# Altium project A3000_4MB.PrjPcb
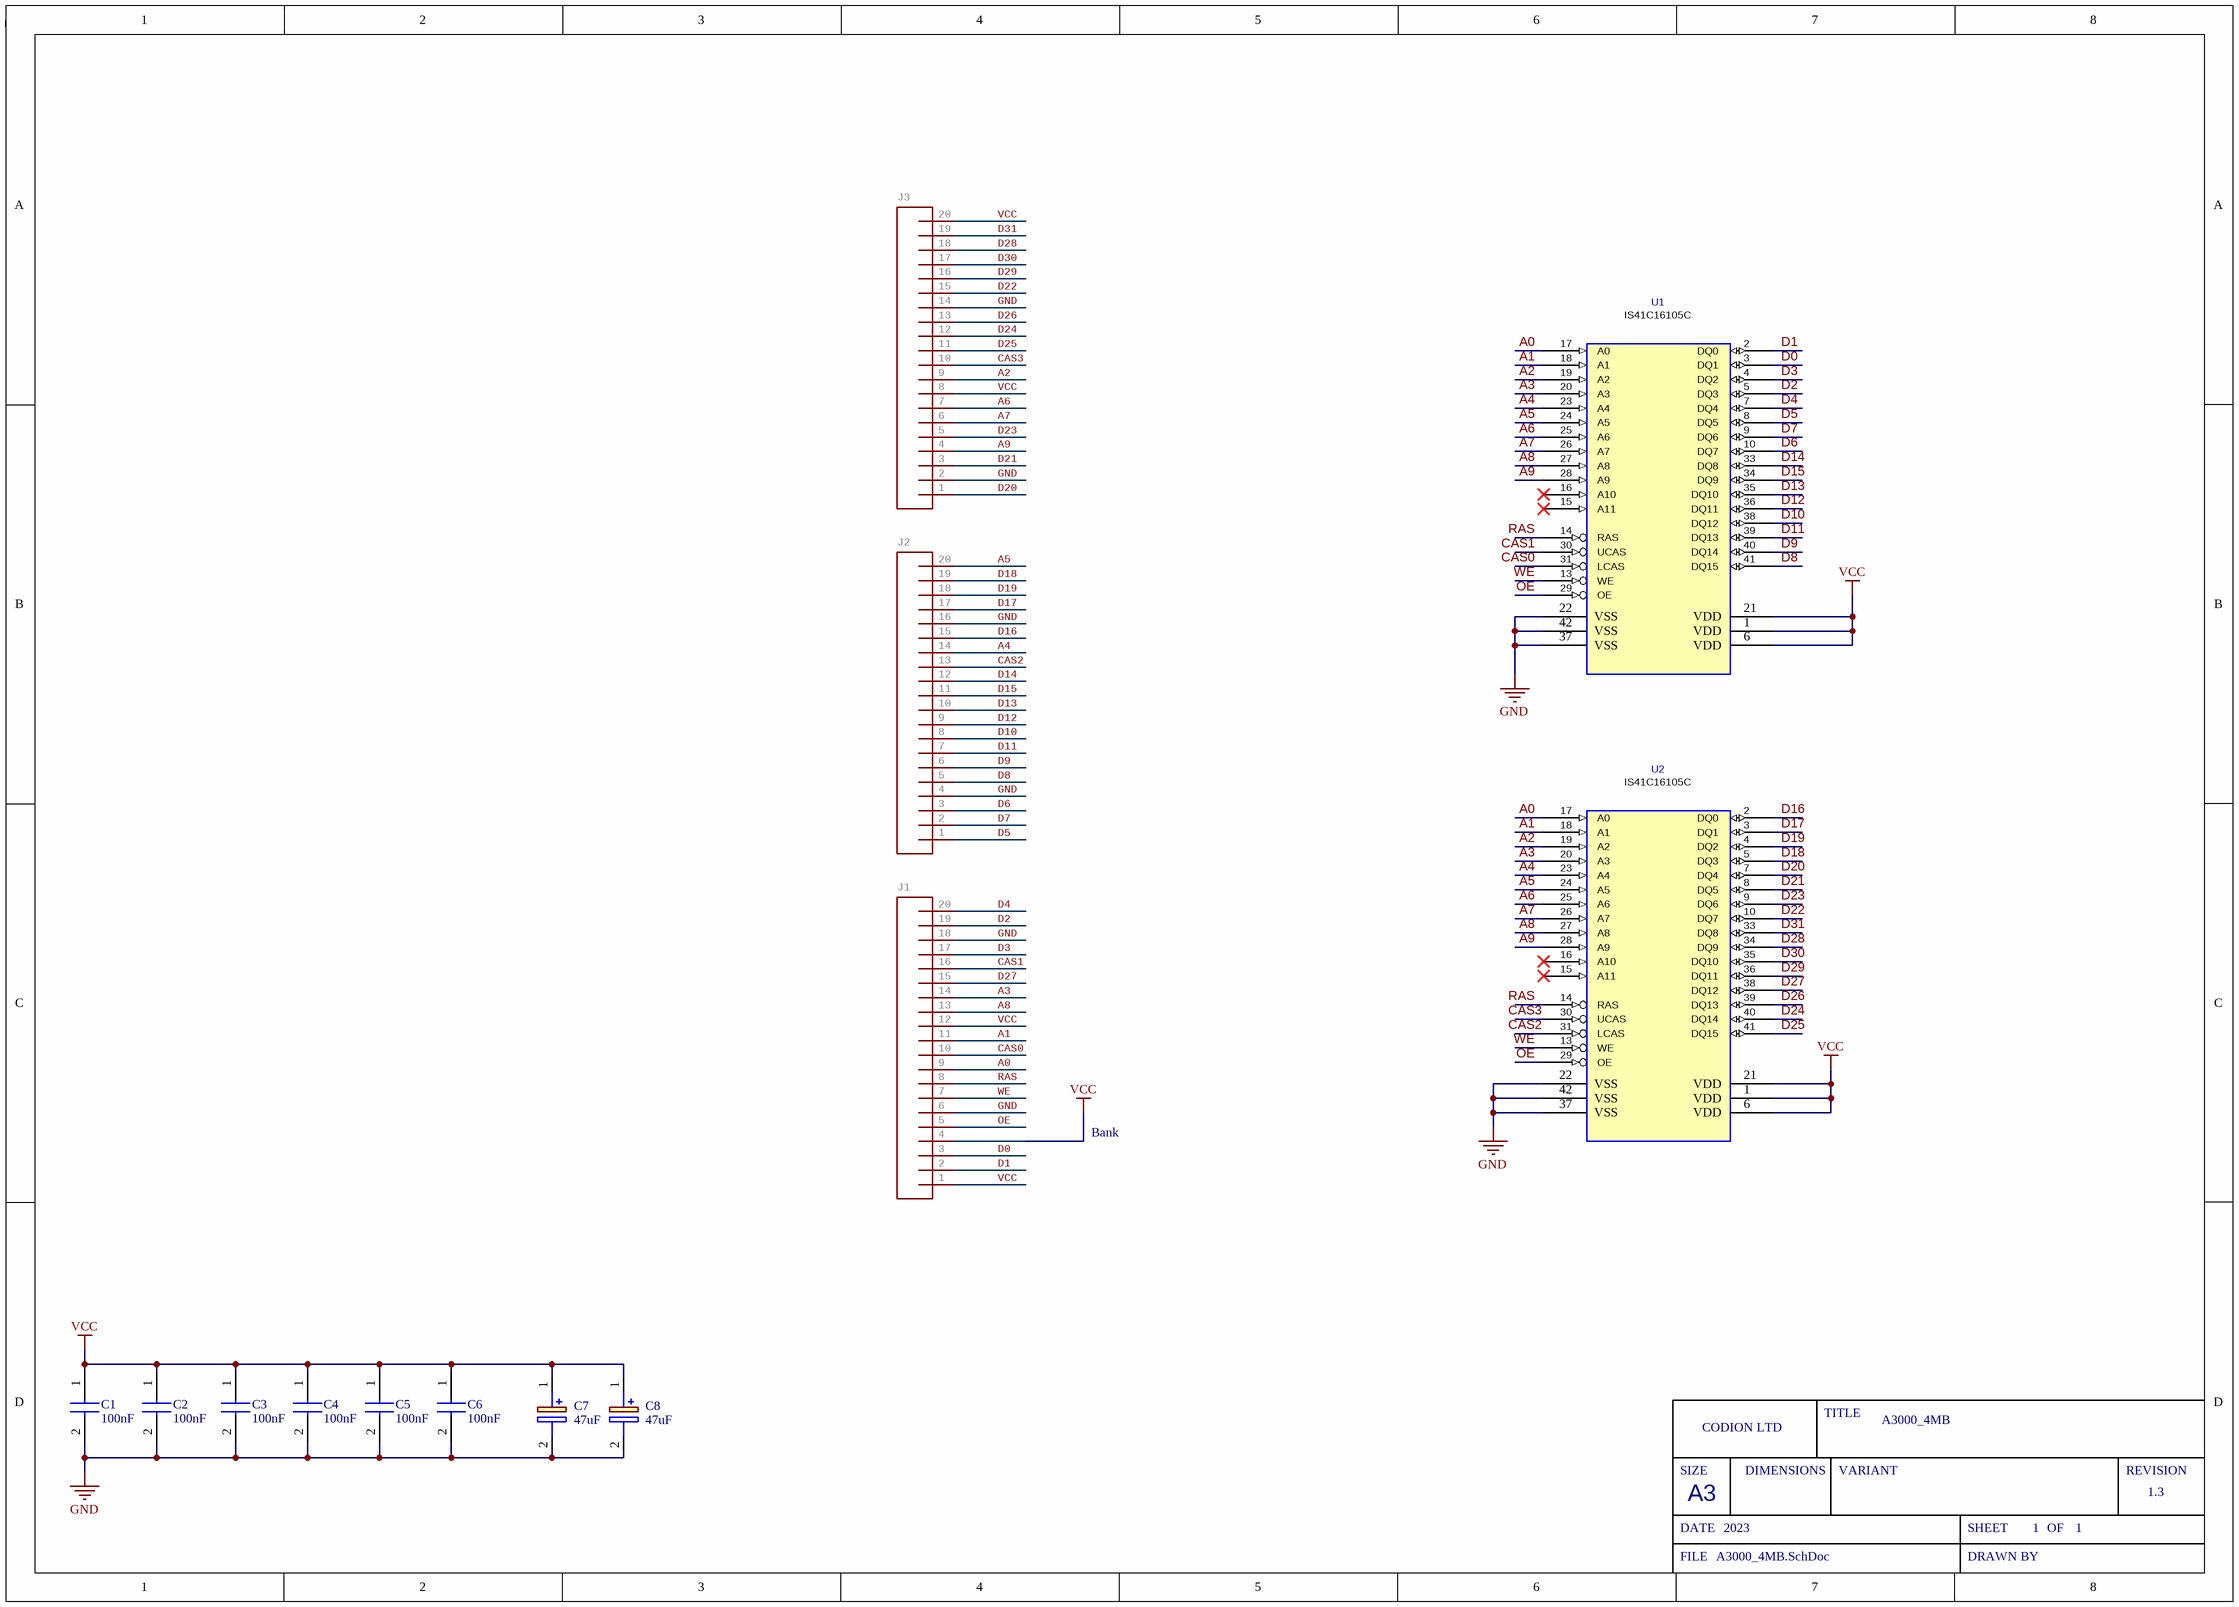
[diagram p0: A3000_4MB.SchDoc]
Sch_RevNo: 1.3; Sch_releaseDate: 2023; Project_Title: A3000_4MB; ProjectName: A3000_4MB; PCB_RevNo: 1.3; Engineer_Name: Codion Ltd; BOM_RevNo: 1.0
1 sheet, 13 parts. Net scope: global (net labels, ports and power ports of the same name join across sheets).
Board file: A3000_4MB.pcbdoc

## Sheet A3000_4MB.SchDoc: ARM2 to ARM3 Adapter
size A3; DocumentNumber: 1; SheetNumber: 1; SheetTotal: 1

### Parts
C1  100nF  [CAPC2012X145N]
C2  100nF  [CAPC2012X145N]
C3  100nF  [CAPC2012X145N]
C4  100nF  [CAPC2012X145N]
C5  100nF  [CAPC2012X145N]
C6  100nF  [CAPC2012X145N]
C7  47uF  [EEE1AA101SP]
C8  47uF  [EEE1AA101SP]
J1  CONN_20  [1X20]  (value not drawn)
J2  CONN_20  [1X20]  (value not drawn)
J3  CONN_20  [1X20]  (value not drawn)
U1  IS41C16105C  [SOJ-42]
U2  IS41C16105C  [SOJ-42]

### Nets
GND: C1.2 C2.2 C3.2 C4.2 C5.2 C6.2 C7.2(-) C8.2(-) J1.6 J1.18 J2.4 J2.16 J3.2 J3.14 U1.22(VSS) U1.37(VSS) U1.42(VSS) U2.22(VSS) U2.37(VSS) U2.42(VSS)
VCC: C1.1 C2.1 C3.1 C4.1 C5.1 C6.1 C7.1(+) C8.1(+) J1.1 J1.4 J1.12 J3.8 J3.20 U1.1(VCC) U1.6(VCC) U1.21(VCC) U2.1(VCC) U2.6(VCC) U2.21(VCC)
A0: J1.9 U1.17(A0) U2.17(A0)
A1: J1.11 U1.18(A1) U2.18(A1)
A2: J3.9 U1.19(A2) U2.19(A2)
A3: J1.14 U1.20(A3) U2.20(A3)
A4: J2.14 U1.23(A4) U2.23(A4)
A5: J2.20 U1.24(A5) U2.24(A5)
A6: J3.7 U1.25(A6) U2.25(A6)
A7: J3.6 U1.26(A7) U2.26(A7)
A8: J1.13 U1.27(A8) U2.27(A8)
A9: J3.4 U1.28(A9) U2.28(A9)
CAS0: J1.10 U1.31(LCAS)
CAS1: J1.16 U1.30(UCAS)
CAS2: J2.13 U2.31(LCAS)
CAS3: J3.10 U2.30(UCAS)
D0: J1.3 U1.3(DQ1)
D1: J1.2 U1.2(DQ0)
D2: J1.19 U1.5(DQ3)
D3: J1.17 U1.4(DQ2)
D4: J1.20 U1.7(DQ4)
D5: J2.1 U1.8(DQ5)
D6: J2.3 U1.10(DQ7)
D7: J2.2 U1.9(DQ6)
D8: J2.5 U1.41(DQ15)
D9: J2.6 U1.40(DQ14)
D10: J2.8 U1.38(DQ12)
D11: J2.7 U1.39(DQ13)
D12: J2.9 U1.36(DQ11)
D13: J2.10 U1.35(DQ10)
D14: J2.12 U1.33(DQ8)
D15: J2.11 U1.34(DQ9)
D16: J2.15 U2.2(DQ0)
D17: J2.17 U2.3(DQ1)
D18: J2.19 U2.5(DQ3)
D19: J2.18 U2.4(DQ2)
D20: J3.1 U2.7(DQ4)
D21: J3.3 U2.8(DQ5)
D22: J3.15 U2.10(DQ7)
D23: J3.5 U2.9(DQ6)
D24: J3.12 U2.40(DQ14)
D25: J3.11 U2.41(DQ15)
D26: J3.13 U2.39(DQ13)
D27: J1.15 U2.38(DQ12)
D28: J3.18 U2.34(DQ9)
D29: J3.16 U2.36(DQ11)
D30: J3.17 U2.35(DQ10)
D31: J3.19 U2.33(DQ8)
OE: J1.5 U1.29(OE) U2.29(OE)
RAS: J1.8 U1.14(RAS) U2.14(RAS)
WE: J1.7 U1.13(WE) U2.13(WE)

Not connected (* = marked no-connect by the designer): U1 15(A11)* 16(A10)*; U2 15(A11)* 16(A10)*

### Notes on the sheet
- Bank
- SIZE
- CODION LTD
- DIMENSIONS
- TITLE
- VARIANT
- REVISION
- DATE
- A3
- SHEET
- OF
- FILE
- DRAWN BY

### Library data of the parts
C1-C6 = C2012X7R1H104K125AM: Capacitor; Manufacturer_Name: TDK; Datasheet Link: https://product.tdk.com/info/en/catalog/datasheets/mlcc_commercial_midvoltage_en.pdf; Height: 1.45mm; Manufacturer_Part_Number: C2012X7R1H104K125AM; Mouser Part Number: 810-C2012X7R1H104KT5; Mouser Price/Stock: https://www.mouser.com/Search/Refine.aspx?Keyword=810-C2012X7R1H104KT5; Arrow Part Number: C2012X7R1H104K125AM; Arrow Price/Stock: https://www.arrow.com/en/products/c2012x7r1h104k125am/tdk
C7 C8 = EEE1VA470WP: Capacitor Polarised; Manufacturer_Name: Panasonic; Datasheet Link: http://industrial.panasonic.com/cdbs/www-data/pdf/RDE0000/ABA0000C1145.pdf; Height: 7.8mm; Manufacturer_Part_Number: EEE1VA470WP
J1-J3 = CONN_20: GateName_1: G$1; SymbolName_1: CONN_20; LibraryName: SparkFun-Connectors; DeviceSetName: CONN_20
U1 U2 = DRAM_1MX16_SOJ: Value: IS41C16105C